# EasyEDA Pro project ProPrj_UNO2FL32x8_COMM_pro_2026-06-11.epro, schematic UNO2FL32x8_COMM
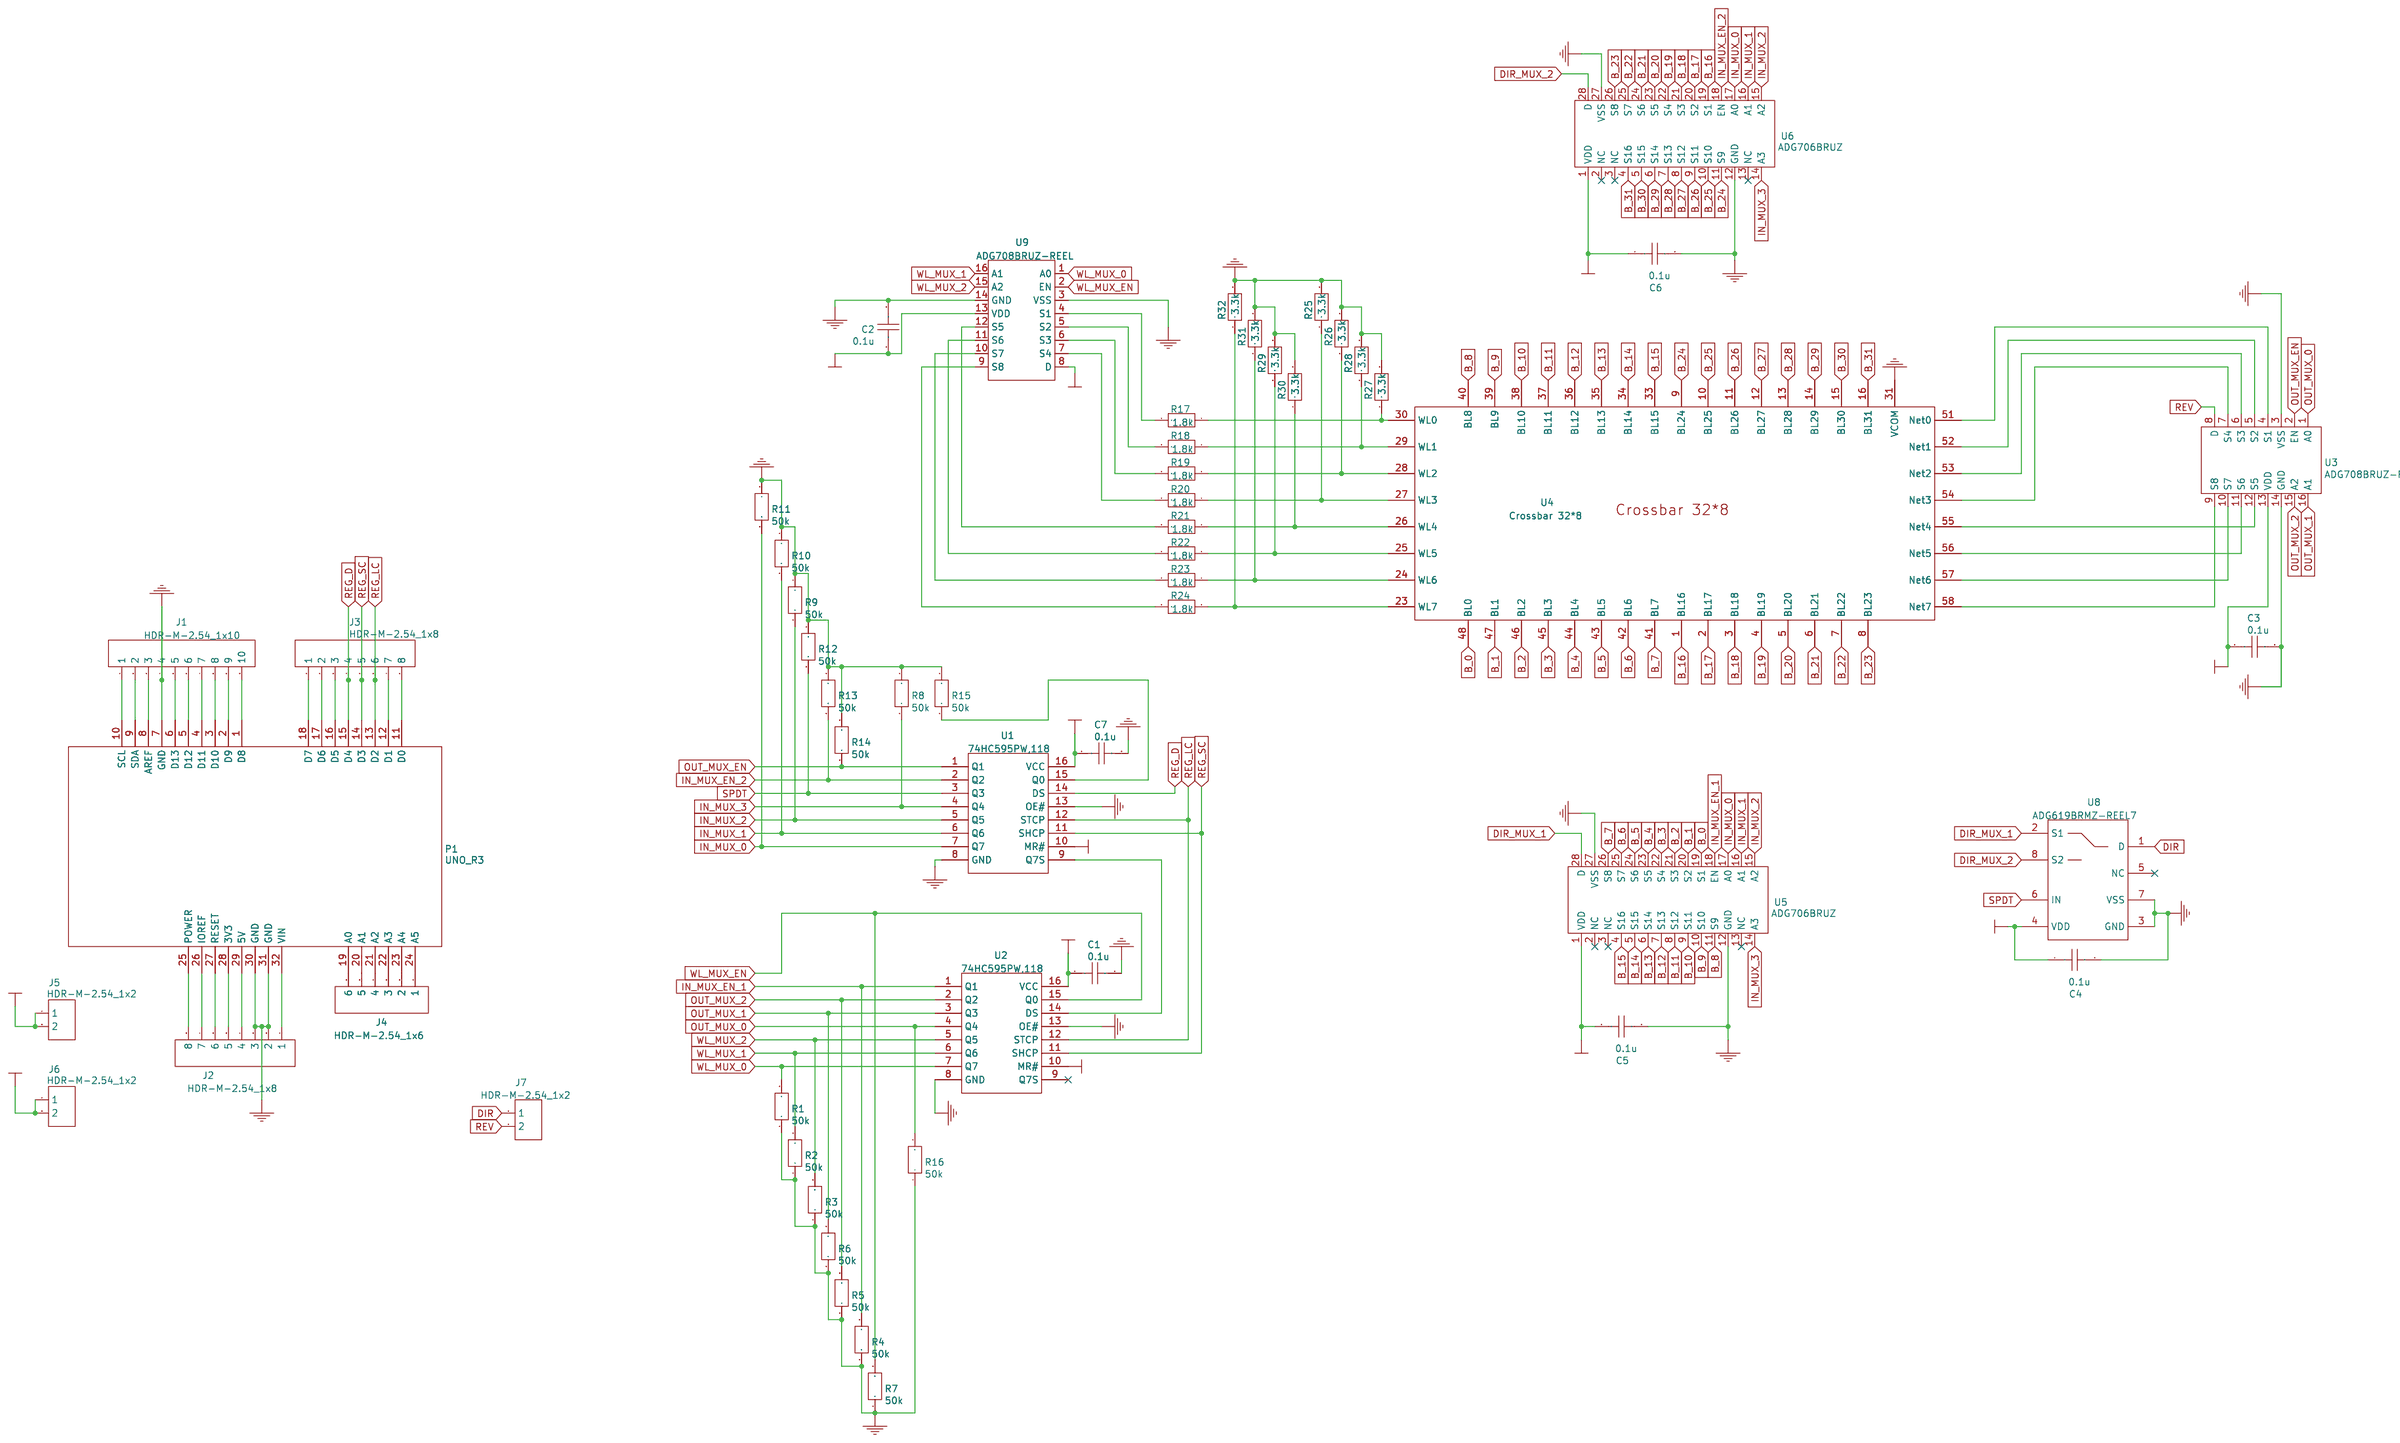
[diagram p1: schematic sheet]

## Parts
C1  0.1u  [C0805]
C2  0.1u  [C0805]
C3  0.1u  [C0805]
C4  0.1u  [C0805]
C5  0.1u  [C0805]
C6  0.1u  [C0805]
C7  0.1u  [C0805]
J1  HDR-M-2.54_1x10  [HDR-M-2.54_1X10]
J2  HDR-M-2.54_1x8  [HDR-M-2.54_1X8]
J3  HDR-M-2.54_1x8  [HDR-M-2.54_1X8]
J4  HDR-M-2.54_1x6  [HDR-M-2.54_1X6]
J5  HDR-M-2.54_1x2  [HDR-M-2.54_1X2]
J6  HDR-M-2.54_1x2  [HDR-M-2.54_1X2]
J7  HDR-M-2.54_1x2  [HDR-M-2.54_1X2]
P1  UNO_R3
R1  50k  [R1206]
R2  50k  [R1206]
R3  50k  [R1206]
R4  50k  [R1206]
R5  50k  [R1206]
R6  50k  [R1206]
R7  50k  [R1206]
R8  50k  [R1206]
R9  50k  [R1206]
R10  50k  [R1206]
R11  50k  [R1206]
R12  50k  [R1206]
R13  50k  [R1206]
R14  50k  [R1206]
R15  50k  [R1206]
R16  50k  [R1206]
R17  1.8k  [R1206]
R18  1.8k  [R1206]
R19  1.8k  [R1206]
R20  1.8k  [R1206]
R21  1.8k  [R1206]
R22  1.8k  [R1206]
R23  1.8k  [R1206]
R24  1.8k  [R1206]
R25  3.3k  [R1206]
R26  3.3k  [R1206]
R27  3.3k  [R1206]
R28  3.3k  [R1206]
R29  3.3k  [R1206]
R30  3.3k  [R1206]
R31  3.3k  [R1206]
R32  3.3k  [R1206]
U1  74HC595PW,118  [TSSOP-16_L5.0-W4.4-P0.65-LS6.4-BL]
U2  74HC595PW,118  [TSSOP-16_L5.0-W4.4-P0.65-LS6.4-BL]
U3  ADG708BRUZ-REEL  [TSSOP-16_L5.0-W4.4-P0.65-LS6.4-BL]
U4  Crossbar 32*8  [CROSSBARR32*8_NO_SCREW]
U5  ADG706BRUZ  [TSSOP-28_L9.7-W4.4-P0.65-LS6.4-BL]
U6  ADG706BRUZ  [TSSOP-28_L9.7-W4.4-P0.65-LS6.4-BL]
U8  ADG619BRMZ-REEL7  [MSOP-8_L3.0-W3.0-P0.65-LS4.9-TL]
U9  ADG708BRUZ-REEL  [TSSOP-16_L5.0-W4.4-P0.65-LS6.4-BL]

## Library data of the parts
C1-C7 = 0.1u
J1 = HDR-M-2.54_1x10: Supplier Part: C57369; Supplier: LCSC
J2 J3 = HDR-M-2.54_1x8: Supplier Part: C190820; Supplier: LCSC
J4 = HDR-M-2.54_1x6: Supplier Part: C190819; Supplier: LCSC
J5-J7 = HDR-M-2.54_1x2: Supplier Part: C124375; Supplier: LCSC
P1 = UNO_R3
R1-R16 = 50k
R17-R24 = 1.8k
R25-R32 = 3.3k
U1 U2 = 74HC595PW,118: Supplier: LCSC; Manufacturer: Nexperia(安世); Supplier Part: C5948; JLCPCB Part Class: Extended Part
U3 U9 = ADG708BRUZ-REEL: Supplier: LCSC; Supplier Part: C657577; Manufacturer: ADI(亚德诺); JLCPCB Part Class: Extended Part
U4 = Crossbar 32*8
U5 U6 = ADG706BRUZ: Supplier: LCSC; Supplier Part: C408400; Manufacturer: ADI(亚德诺)/LINEAR(凌特); Manufacturer Part: ADG706BRUZ-REEL7; JLCPCB Part Class: Extended Part
U8 = ADG619BRMZ-REEL7: Supplier: LCSC; Manufacturer: ADI(亚德诺)/LINEAR(凌特); Supplier Part: C141957; JLCPCB Part Class: Extended Part

## Nets
GND: C1.2 C2.2 C3.2 C4.2 C5.2 C6.2 C7.2 J1.4 J2.2 J2.3 P1.7(GND) P1.30(GND) P1.31(GND) R1.1 R2.1 R3.1 R4.1 R5.1 R6.1 R7.1 R8.1 R9.1 R10.1 R11.1 R12.1 R13.1 R14.1 R15.1 R16.1 R25.2 R26.2 R27.2 R28.2 R29.2 R30.2 R31.2 R32.2 U1.8(GND) U1.13(OE#) U2.8(GND) U2.13(OE#) U3.3(VSS) U3.14(GND) U4.31(VCOM) U5.12(GND) U5.27(VSS) U6.12(GND) U6.27(VSS) U8.3(GND) U8.7(VSS) U9.3(VSS) U9.14(GND)
VCCA: C2.1 C3.1 C4.1 C5.1 C6.1 J6.1 J6.2 U3.13(VDD) U5.1(VDD) U6.1(VDD) U8.4(VDD) U9.8(D) U9.13(VDD)
VCCD: C1.1 C7.1 J5.1 J5.2 U1.10(MR#) U1.16(VCC) U2.10(MR#) U2.16(VCC)
B_0: U4.48(BL0) U5.19(S1)
B_1: U4.47(BL1) U5.20(S2)
B_2: U4.46(BL2) U5.21(S3)
B_3: U4.45(BL3) U5.22(S4)
B_4: U4.44(BL4) U5.23(S5)
B_5: U4.43(BL5) U5.24(S6)
B_6: U4.42(BL6) U5.25(S7)
B_7: U4.41(BL7) U5.26(S8)
B_8: U4.40(BL8) U5.11(S9)
B_9: U4.39(BL9) U5.10(S10)
B_10: U4.38(BL10) U5.9(S11)
B_11: U4.37(BL11) U5.8(S12)
B_12: U4.36(BL12) U5.7(S13)
B_13: U4.35(BL13) U5.6(S14)
B_14: U4.34(BL14) U5.5(S15)
B_15: U4.33(BL15) U5.4(S16)
B_16: U4.1(BL16) U6.19(S1)
B_17: U4.2(BL17) U6.20(S2)
B_18: U4.3(BL18) U6.21(S3)
B_19: U4.4(BL19) U6.22(S4)
B_20: U4.5(BL20) U6.23(S5)
B_21: U4.6(BL21) U6.24(S6)
B_22: U4.7(BL22) U6.25(S7)
B_23: U4.8(BL23) U6.26(S8)
B_24: U4.9(BL24) U6.11(S9)
B_25: U4.10(BL25) U6.10(S10)
B_26: U4.11(BL26) U6.9(S11)
B_27: U4.12(BL27) U6.8(S12)
B_28: U4.13(BL28) U6.7(S13)
B_29: U4.14(BL29) U6.6(S14)
B_30: U4.15(BL30) U6.5(S15)
B_31: U4.16(BL31) U6.4(S16)
DIR: J7.1 U8.1(D)
DIR_MUX_1: U5.28(D) U8.2(S1)
DIR_MUX_2: U6.28(D) U8.8(S2)
IN_MUX_0: R11.2 U1.7(Q7) U5.17(A0) U6.17(A0)
IN_MUX_1: R10.2 U1.6(Q6) U5.16(A1) U6.16(A1)
IN_MUX_2: R9.2 U1.5(Q5) U5.15(A2) U6.15(A2)
IN_MUX_3: R8.2 U1.4(Q4) U5.14(A3) U6.14(A3)
IN_MUX_EN_1: R4.2 U2.1(Q1) U5.18(EN)
IN_MUX_EN_2: R13.2 U1.2(Q2) U6.18(EN)
OUT_MUX_0: R16.2 U2.4(Q4) U3.1(A0)
OUT_MUX_1: R6.2 U2.3(Q3) U3.16(A1)
OUT_MUX_2: R5.2 U2.2(Q2) U3.15(A2)
OUT_MUX_EN: R14.2 U1.1(Q1) U3.2(EN)
REG_D: J3.4 P1.15(D4) U1.14(DS)
REG_LC: J3.6 P1.13(D2) U1.12(STCP) U2.12(STCP)
REG_SC: J3.5 P1.14(D3) U1.11(SHCP) U2.11(SHCP)
REV: J7.2 U3.8(D)
SPDT: R12.2 U1.3(Q3) U8.6(IN)
WL_MUX_0: R1.2 U2.7(Q7) U9.1(A0)
WL_MUX_1: R2.2 U2.6(Q6) U9.16(A1)
WL_MUX_2: R3.2 U2.5(Q5) U9.15(A2)
WL_MUX_EN: R7.2 U2.15(Q0) U9.2(EN)
Net-(J1-1): J1.1 P1.10(SCL)
Net-(J1-2): J1.2 P1.9(SDA)
Net-(J1-3): J1.3 P1.8(AREF)
Net-(J1-5): J1.5 P1.6(D13)
Net-(J1-6): J1.6 P1.5(D12)
Net-(J1-7): J1.7 P1.4(D11)
Net-(J1-8): J1.8 P1.3(D10)
Net-(J1-9): J1.9 P1.2(D9)
Net-(J1-10): J1.10 P1.1(D8)
Net-(J2-1): J2.1 P1.32(VIN)
Net-(J2-4): J2.4 P1.29(5V)
Net-(J2-5): J2.5 P1.28(3V3)
Net-(J2-6): J2.6 P1.27(RESET)
Net-(J2-7): J2.7 P1.26(IOREF)
Net-(J2-8): J2.8 P1.25(POWER)
Net-(J3-1): J3.1 P1.18(D7)
Net-(J3-2): J3.2 P1.17(D6)
Net-(J3-3): J3.3 P1.16(D5)
Net-(J3-7): J3.7 P1.12(D1)
Net-(J3-8): J3.8 P1.11(D0)
Net-(J4-1): J4.1 P1.24(A5)
Net-(J4-2): J4.2 P1.23(A4)
Net-(J4-3): J4.3 P1.22(A3)
Net-(J4-4): J4.4 P1.21(A2)
Net-(J4-5): J4.5 P1.20(A1)
Net-(J4-6): J4.6 P1.19(A0)
U1_9: U1.9(Q7S) U2.14(DS)
U1_15: R15.2 U1.15(Q0)
U4_23: R24.1 R32.1 U4.23(WL7)
U4_24: R23.1 R31.1 U4.24(WL6)
U4_25: R22.1 R29.1 U4.25(WL5)
U4_26: R21.1 R30.1 U4.26(WL4)
U4_27: R20.1 R25.1 U4.27(WL3)
U4_28: R19.1 R26.1 U4.28(WL2)
U4_29: R18.1 R28.1 U4.29(WL1)
U4_30: R17.1 R27.1 U4.30(WL0)
U4_51: U3.4(S1) U4.51(Net0)
U4_52: U3.5(S2) U4.52(Net1)
U4_53: U3.6(S3) U4.53(Net2)
U4_54: U3.7(S4) U4.54(Net3)
U4_55: U3.12(S5) U4.55(Net4)
U4_56: U3.11(S6) U4.56(Net5)
U4_57: U3.10(S7) U4.57(Net6)
U4_58: U3.9(S8) U4.58(Net7)
U9_4: R17.2 U9.4(S1)
U9_5: R18.2 U9.5(S2)
U9_6: R19.2 U9.6(S3)
U9_7: R20.2 U9.7(S4)
U9_9: R24.2 U9.9(S8)
U9_10: R23.2 U9.10(S7)
U9_11: R22.2 U9.11(S6)
U9_12: R21.2 U9.12(S5)

Not connected (* = marked no-connect by the designer): U2 9(Q7S)*; U5 2(NC)* 3(NC)* 13(NC)*; U6 2(NC)* 3(NC)* 13(NC)*; U8 5(NC)*
